# EAGLE design teensy_protocol_xl8r_3_6 (EAGLE 8.5.2)
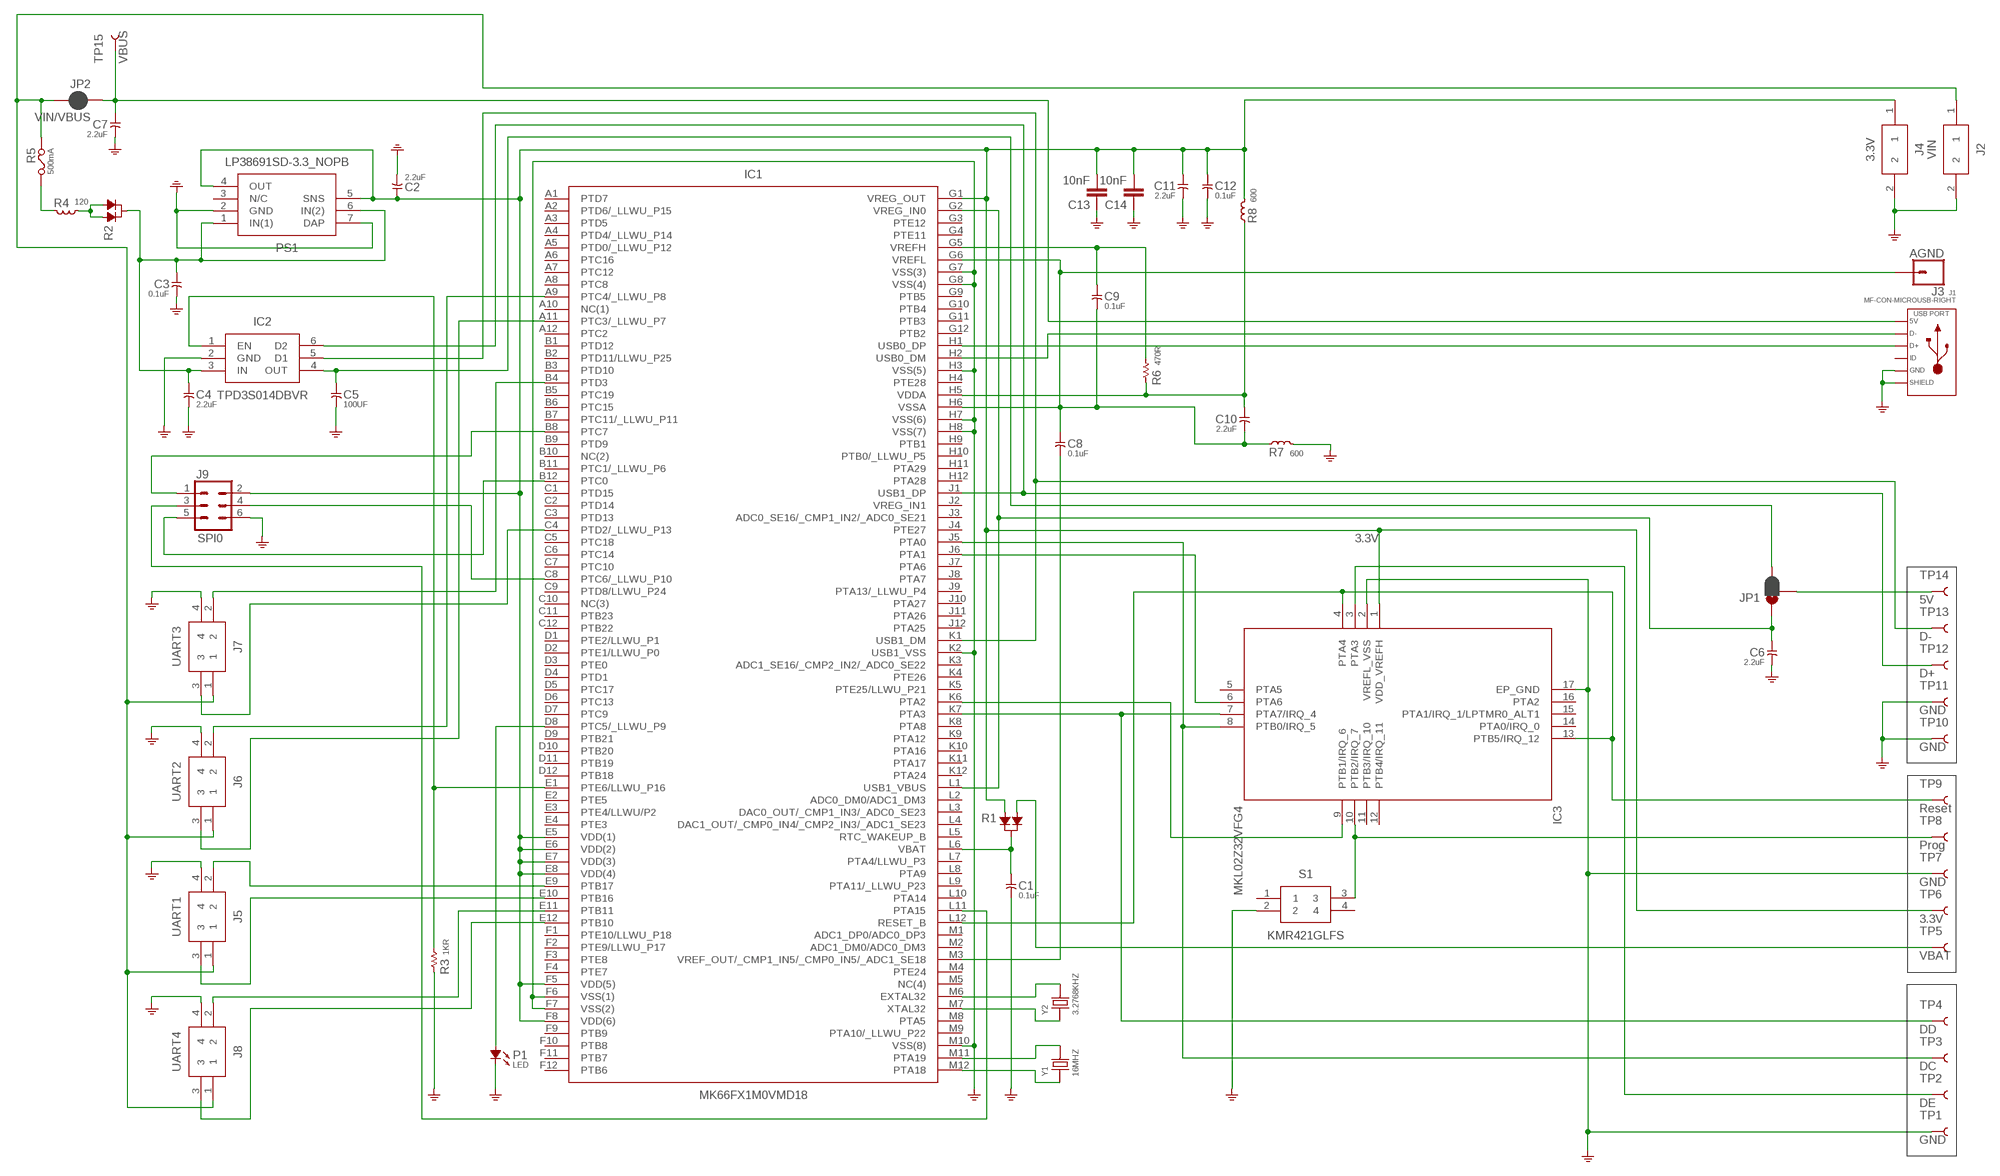
[diagram p0: schematic, sheet 1]

## Parts
C1  0.1uF  CAPACITOR-0.1UF  [C0603]
C2  2.2uF  CAPACITOR-2.2UF  [C0805]
C3  0.1uF  CAPACITOR-0.1UF  [C0603]
C4  2.2uF  CAPACITOR-2.2UF  [C0805]
C5  100UF  CAPACITOR-100UF  [C1206]
C6  2.2uF  CAPACITOR-2.2UF  [C0805]
C7  2.2uF  CAPACITOR-2.2UF  [C0805]
C8  0.1uF  CAPACITOR-0.1UF  [C0603]
C9  0.1uF  CAPACITOR-0.1UF  [C0603]
C10  2.2uF  CAPACITOR-2.2UF  [C0805]
C11  2.2uF  CAPACITOR-2.2UF  [C0805]
C12  0.1uF  CAPACITOR-0.1UF  [C0603]
C13  10nF  10NF-0603-50V-10%  [0603]
C14  10nF  10NF-0603-50V-10%  [0603]
IC1  MK66FX1M0VMD18  [BGA144C100P12X12_1300X1300X170]
IC2  TPD3S014DBVR  [SOT95P280X145-6N]
IC3  MKL02Z32VFG4  [QFN50P300X300X65-17N]
J1  MF-CON-MICROUSB-RIGHT  USB_MICRO_RIGHT  [MICROUSB-RIGHT]
J2  VIN  SM02B-GHS-TB(LF)(SN)  [SM02B-GHS-TB]
J3  AGND  CONN_01  [1X01]
J4  3.3V  SM02B-GHS-TB(LF)(SN)  [SM02B-GHS-TB]
J5  UART1  SM04B-GHS-TB(LF)(SN)  [SM04B-GHS-TB]
J6  UART2  SM04B-GHS-TB(LF)(SN)  [SM04B-GHS-TB]
J7  UART3  SM04B-GHS-TB(LF)(SN)  [SM04B-GHS-TB]
J8  UART4  SM04B-GHS-TB(LF)(SN)  [SM04B-GHS-TB]
J9  SPI0  CONN_03X2FEMALE  [2X3]
JP1  JUMPER-SMT_3_1-NC_PASTE_SILK  [SMT-JUMPER_3_1-NC_PASTE_SILK]
JP2  VIN/VBUS  JUMPER-SMT_2_NC_PASTE_SILK  [SMT-JUMPER_2_NC_PASTE_SILK]
P1  LED  [LED-0805]
PS1  LP38691SD-3.3_NOPB  [SON95P300X300X80-7N]
R1  DIODE_DUAL  [SOT-23]
R2  DIODE_DUAL  [SOT-23]
R3  1KR  RESISTOR-1KR  [R0603]
R4  120  FERRITE  [L0603]
R5  500mA  FUSE  [F0805]
R6  470R  RESISTOR-470R  [R0603]
R7  600  FERRITE  [L0603]
R8  600  FERRITE  [L0603]
S1  KMR421GLFS  [KMR_2]
TP1  GND  TEST-POINT3  [PAD.03X.03]
TP2  DE  TEST-POINT3  [PAD.03X.03]
TP3  DC  TEST-POINT3  [PAD.03X.03]
TP4  DD  TEST-POINT3  [PAD.03X.03]
TP5  VBAT  TEST-POINT3  [PAD.03X.03]
TP6  3.3V  TEST-POINT3  [PAD.03X.03]
TP7  GND  TEST-POINT3  [PAD.03X.03]
TP8  Prog  TEST-POINT3  [PAD.03X.03]
TP9  Reset  TEST-POINT3  [PAD.03X.03]
TP10  GND  TEST-POINT3  [PAD.03X.03]
TP11  GND  TEST-POINT3  [PAD.03X.03]
TP12  D+  TEST-POINT3  [PAD.03X.03]
TP13  D-  TEST-POINT3  [PAD.03X.03]
TP14  5V  TEST-POINT3  [PAD.03X.03]
TP15  VBUS  TEST-POINT3  [PAD.03X.03]
Y1  16MHZ  SMD-CRYSTAL-16MHZ-8PF-20PPM-40R(2P-5.0X3.2MM)  [X2-SMD-5.0X3.2X1.3MM]
Y2  3.2768KHZ  SMD-CRYSTAL-32.768KHZ-12.5PF-20PPM-90K(2P-L2.0X1.2MM)  [X2-SMD-L2.0X1.2X0.55MM]

## Nets
3.3V: C2.1 C11.1 C12.1 C13.2 C14.2 IC1.E5(VDD(1)) IC1.E6(VDD(2)) IC1.E7(VDD(3)) IC1.E8(VDD(4)) IC1.F5(VDD(5)) IC1.F8(VDD(6)) IC1.G1(VREG_OUT) IC3.1(VDD_VREFH) J4.1 J9.2 PS1.4(OUT) PS1.5(SNS) R1.2 R8.2 TP6.P$1
CS0: IC1.B12(PTC0) J9.5
GND [GND]: C1.2 C2.2 C3.2 C4.2 C5.2 C6.2 C7.2 C11.2 C12.2 C13.1 C14.1 IC1.F6(VSS(1)) IC1.F7(VSS(2)) IC1.G7(VSS(3)) IC1.G8(VSS(4)) IC1.H3(VSS(5)) IC1.H7(VSS(6)) IC1.H8(VSS(7)) IC1.K2(USB1_VSS) IC1.M10(VSS(8)) IC2.2(GND) IC3.2(VREFL_VSS) IC3.17(EP_GND) J1.5(GND) J1.S1(SLD) J1.S2(SLD) J1.S3(SLD) J1.S4(SLD) J1.S5(SLD) J1.S6(SLD) J2.2 J4.2 J5.4 J6.4 J7.4 J8.4 J9.6 P1.- PS1.2(GND) PS1.7(DAP) R3.1 R7.2 S1.2 TP1.P$1 TP7.P$1 TP10.P$1 TP11.P$1
MISO0: IC1.B8(PTC7) J9.1
MOSI0: IC1.C8(PTC6/_LLWU_P10) J9.4
N$1: IC1.K7(PTA3) IC3.7(PTA7/IRQ_4) TP4.P$1
N$2: IC1.J5(PTA0) IC3.8(PTB0/IRQ_5) TP3.P$1
N$3: IC1.K6(PTA2) IC3.9(PTB1/IRQ_6)
N$4: IC1.J6(PTA1) IC3.6(PTA6)
N$5: IC1.L12(RESET_B) IC3.4(PTA4) IC3.13(PTB5/IRQ_12) TP9.P$1
N$6: IC3.10(PTB2/IRQ_7) S1.3 TP8.P$1
N$7: IC3.3(PTA3) TP2.P$1
N$8 [GND]: C1.1 IC1.L6(VBAT) R1.3
N$9: IC1.E1(PTE6/LLWU_P16) IC2.1(EN) R3.2
N$10 [SUPPLY]: C3.1 C4.1 IC2.3(IN) PS1.1(IN(1)) PS1.6(IN(2)) R2.3
N$11: C5.1 IC2.4(OUT) JP1.3
N$12: C6.1 IC1.G2(VREG_IN0) IC1.L1(USB1_VBUS) JP1.1
N$13: IC1.K1(USB1_DM) IC2.5(D1) TP13.P$1
N$14: IC1.J1(USB1_DP) IC2.6(D2) TP12.P$1
N$15: IC1.M6(EXTAL32) Y2.2
N$16: IC1.M7(XTAL32) Y2.1
N$17 [SUPPLY]: JP1.2 TP14.P$1
N$18 [SUPPLY]: R2.1 R2.2 R4.2
N$19 [SUPPLY]: R4.1 R5.2
N$20: IC1.M11(PTA19) Y1.2
N$21: IC1.M12(PTA18) Y1.1
N$23 [GND]: C8.1 C9.2 C10.2 IC1.G6(VREFL) IC1.H6(VSSA) J3.1 R7.1
N$24: C8.2 IC1.M3(VREF_OUT/_CMP1_IN5/_CMP0_IN5/_ADC1_SE18)
N$25 [GND]: C9.1 IC1.G5(VREFH) R6.2
N$26 [GND]: C10.1 IC1.H5(VDDA) R6.1 R8.1
N$27: IC1.D8(PTC5/_LLWU_P9) P1.+
RX1: IC1.E9(PTB17) J5.2
RX2: IC1.A11(PTC3/_LLWU_P7) J6.3
RX3: IC1.C4(PTD2/_LLWU_P13) J7.3
RX4: IC1.E12(PTB10) J8.3
SCK0: IC1.L11(PTA15) J9.3
TX1: IC1.E10(PTB16) J5.3
TX2: IC1.A9(PTC4/_LLWU_P8) J6.2
TX3: IC1.B4(PTD3) J7.2
TX4: IC1.E11(PTB11) J8.2
USB0_DM [GND]: IC1.H2(USB0_DM) J1.2(D-)
USB0_DP [GND]: IC1.H1(USB0_DP) J1.3(D+)
VBAT [SUPPLY]: R1.1 TP5.P$1
VBUS [SUPPLY]: C7.1 J1.1(5V) JP2.1 TP15.P$1
VIN [SUPPLY]: J2.1 J5.1 J6.1 J7.1 J8.1 JP2.2 R5.1
Unconnected: IC1.A1(PTD7) IC1.A2(PTD6/_LLWU_P15) IC1.A3(PTD5) IC1.A4(PTD4/_LLWU_P14) IC1.A5(PTD0/_LLWU_P12) IC1.A6(PTC16) IC1.A7(PTC12) IC1.A8(PTC8) IC1.A10(NC(1)) IC1.A12(PTC2) IC1.B1(PTD12) IC1.B2(PTD11/LLWU_P25) IC1.B3(PTD10) IC1.B5(PTC19) IC1.B6(PTC15) IC1.B7(PTC11/_LLWU_P11) IC1.B9(PTD9) IC1.B10(NC(2)) IC1.B11(PTC1/_LLWU_P6) IC1.C1(PTD15) IC1.C2(PTD14) IC1.C3(PTD13) IC1.C5(PTC18) IC1.C6(PTC14) IC1.C7(PTC10) IC1.C9(PTD8/LLWU_P24) IC1.C10(NC(3)) IC1.C11(PTB23) IC1.C12(PTB22) IC1.D1(PTE2/LLWU_P1) IC1.D2(PTE1/LLWU_P0) IC1.D3(PTE0) IC1.D4(PTD1) IC1.D5(PTC17) IC1.D6(PTC13) IC1.D7(PTC9) IC1.D9(PTB21) IC1.D10(PTB20) IC1.D11(PTB19) IC1.D12(PTB18) IC1.E2(PTE5) IC1.E3(PTE4/LLWU/P2) IC1.E4(PTE3) IC1.F1(PTE10/LLWU_P18) IC1.F2(PTE9/LLWU_P17) IC1.F3(PTE8) IC1.F4(PTE7) IC1.F9(PTB9) IC1.F10(PTB8) IC1.F11(PTB7) IC1.F12(PTB6) IC1.G3(PTE12) IC1.G4(PTE11) IC1.G9(PTB5) IC1.G10(PTB4) IC1.G11(PTB3) IC1.G12(PTB2) IC1.H4(PTE28) IC1.H9(PTB1) IC1.H10(PTB0/_LLWU_P5) IC1.H11(PTA29) IC1.H12(PTA28) IC1.J2(VREG_IN1) IC1.J3(ADC0_SE16/_CMP1_IN2/_ADC0_SE21) IC1.J4(PTE27) IC1.J7(PTA6) IC1.J8(PTA7) IC1.J9(PTA13/_LLWU_P4) IC1.J10(PTA27) IC1.J11(PTA26) IC1.J12(PTA25) IC1.K3(ADC1_SE16/_CMP2_IN2/_ADC0_SE22) IC1.K4(PTE26) IC1.K5(PTE25/LLWU_P21) IC1.K8(PTA8) IC1.K9(PTA12) IC1.K10(PTA16) IC1.K11(PTA17) IC1.K12(PTA24) IC1.L2(ADC0_DM0/ADC1_DM3) IC1.L3(DAC0_OUT/_CMP1_IN3/_ADC0_SE23) IC1.L4(DAC1_OUT/_CMP0_IN4/_CMP2_IN3/_ADC1_SE23) IC1.L5(RTC_WAKEUP_B) IC1.L7(PTA4/LLWU_P3) IC1.L8(PTA9) IC1.L9(PTA11/_LLWU_P23) IC1.L10(PTA14) IC1.M1(ADC1_DP0/ADC0_DP3) IC1.M2(ADC1_DM0/ADC0_DM3) IC1.M4(PTE24) IC1.M5(NC(4)) IC1.M8(PTA5) IC1.M9(PTA10/_LLWU_P22) IC3.5(PTA5) IC3.11(PTB3/IRQ_10) IC3.12(PTB4/IRQ_11) IC3.14(PTA0/IRQ_0) IC3.15(PTA1/IRQ_1/LPTMR0_ALT1) IC3.16(PTA2) J1.4(ID) PS1.3(N/C) S1.1 S1.4

## Library data of the parts
C1 C3 C8 C9 C12 = t32_ref:CAPACITOR-0.1UF; DESC: 0.1uF / 16VDC / X7R; MF: Murata Electronics; MPN: GRM188R71C104KA01D; OC_MOUSER: 81-GRM39X104K16; PACKAGE: 0603; TYPE: Capacitor
C2 C4 C6 C7 C10 C11 = t32_ref:CAPACITOR-2.2UF; DESC: 2.2uF / 25 VDC / X7R; MF: Taiyo Yuden; MPN: TMK212B7225KG-TR; OC_MOUSER: 963-TMK212B7225KG-TR; PACKAGE: 0805; TYPE: Capacitor
C5 = t32_ref:CAPACITOR-100UF
C13 C14 = SparkFun-Capacitors:10NF: 0.01uF/10nF/10,000pF ceramic capacitors A capacitor is a passive two-terminal electrical component used to store electrical energy temporarily in an electric field. CAP-09321; PROD_ID: CAP-00867
IC1 = MK66FX1M0VMD18:MK66FX1M0VMD18: ARM Microcontrollers - MCU BL Microcontrollers <https://componentsearchengine.com/Images/1/MK66FX1M0VMD18.jpg> Source: Datasheet <http://cache.freescale.com/files/shared/doc/package_info/98ASA00222D.pdf>; DESCRIPTION: ARM Microcontrollers - MCU BL Microcontrollers; HEIGHT: 1.7mm; MANUFACTURER_NAME: Nexperia; MANUFACTURER_PART_NUMBER: MK66FX1M0VMD18; SUPPLIER_NAME: RS
IC2 = TPD3S014DBVR:TPD3S014DBVR: Current Limit Load Sw & TVS 0.5A SOT23-6 Texas Instruments TPD3S014DBVR Load Switch IC, Current Limit Switch, 4.5 5.5V, 6-Pin, SOT-23 <https://componentsearchengine.com/Images/1/TPD3S014DBVR.jpg> Source: Datasheet <http://www.ti.com/lit/ds/symlink/tpd3s044.pdf>; DESCRIPTION: Current Limit Load Sw & TVS 0.5A SOT23-6 Texas Instruments TPD3S014DBVR Load Switch IC, Current Limit Switch, 4.5 5.5V, 6-Pin, SOT-23; HEIGHT: 1.45mm; MANUFACTURER_NAME: Texas Instruments; MANUFACTURER_PART_NUMBER: TPD3S014DBVR; RS_PART_NUMBER: 9009703P; SUPPLIER_NAME: RS
IC3 = MKL02Z32VFG4:MKL02Z32VFG4: Freescale MKL02Z32VFG4, 32bit ARM Cortex M0 Microcontroller, 48MHz, 32 kB Flash, 16-Pin QFN <https://componentsearchengine.com/Images/1/MKL02Z32VFG4.jpg> Source: Datasheet <http://cache.nxp.com/files/32bit/doc/data_sheet/KL02P32M48SF0.pdf>; DESCRIPTION: Freescale MKL02Z32VFG4, 32bit ARM Cortex M0 Microcontroller, 48MHz, 32 kB Flash, 16-Pin QFN; HEIGHT: 0.65mm; MANUFACTURER_NAME: Nexperia; MANUFACTURER_PART_NUMBER: MKL02Z32VFG4; RS_PART_NUMBER: 7884723; SUPPLIER_NAME: RS
J1 = MF_Connectors:USB: Library: MF_Connectors Description: 5 Pin USB Connectors. SLD is the shield connection. Usually tied to ground through a small ferrite bead.; HOUSEPART: YES; MPN: MF-CON-MICROUSB-RIGHT; POPULATE: 1; URL: https://factory.macrofab.com/part/MF-CON-MICROUSB-RIGHT
J2 J4 = SM02B-GHS-TB(LF)(SN):SM02B-GHS-TB(LF)(SN): GH 1.25mm header side entry 2 way JST GH Series, 1.25mm Pitch 2 Way Shrouded Right Angle PCB Header, Surface Mount, Solder Termination <https://componentsearchengine.com/Images/3/SM02B-GHS-TB%28LF%29%28SN%29.jpg> Source: Datasheet <http://docs-europe.electrocomponents.com/webdocs/13ed/0900766b813ed075.pdf>; DESCRIPTION: GH 1.25mm header side entry 2 way JST GH Series, 1.25mm Pitch 2 Way Shrouded Right Angle PCB Header, Surface Mount, Solder Termination; HEIGHT: mm; MANUFACTURER_NAME: JST (JAPAN SOLDERLESS TERMINALS); MANUFACTURER_PART_NUMBER: SM02B-GHS-TB(LF)(SN); RS_PART_NUMBER: 7521790P; SUPPLIER_NAME: RS
J3 = SparkFun-Connectors:CONN_01: Single connection point. Often used as Generic Header-pin footprint for 0.1 inch spaced/style header connections On any of the 0.1 inch spaced packages, you can populate with these: Break Away Headers - Straight <https://www.sparkfun.com/products/116> (PRT-00116) Break Away Male Headers - Right Angle <https://www.sparkfun.com/products/553> (PRT-00553) Female Headers <https://www.sparkfun.com/products/115> (PRT-00115) Break Away Headers - Machine Pin <https://www.sparkfun.com/products/117> (PRT-00117) Break Away Female Headers - Swiss Machine Pin <https://www.sparkfun.com/products/743> (PRT-00743) This device is also useful as a general connection point to wire up your design to another part of your project. Our various solder wires solder well into these plated through hole pads. Hook-Up Wire - Assortment (Stranded, 22 AWG) <https://www.sparkfun.com/products/11375> (PRT-11375) Hook-Up Wire - Assortment (Solid Core, 22 AWG) <https://www.sparkfun.com/products/11367> (PRT-11367) View the entire wire category on our website here <https://www.sparkfun.com/categories/141> Special notes: SMTSO-256-ET is a "flush mount" nut for a 4-40 screw. We mostly use this on specialty testbeds; it is a nice way to connect hardware to your PCB at an adjustable hieght. Also note, the SNAP packages are for using a snappable style connector. We sell a baggie of snaps and they are also used on two LilyPad designs: Snap Assortment - 30 pack (male and female) <https://www.sparkfun.com/products/11347> (DEV-11347) LilyPad Arduino SimpleSnap <https://www.sparkfun.com/products/10941> (DEV-10941) LilyPad SimpleSnap Protoboard <https://www.sparkfun.com/products/10940> (DEV-10940)
J5-J8 = SM04B-GHS-TB(LF)(SN):SM04B-GHS-TB(LF)(SN): JST GH Series, 1.25mm Pitch 4 Way Right Angle PCB Header, Solder Termination, 1A <https://componentsearchengine.com/Images/3/SM04B-GHS-TB%28LF%29%28SN%29.jpg> Source: Datasheet <http://uk.rs-online.com/web/p/products/7521797>; DESCRIPTION: JST GH Series, 1.25mm Pitch 4 Way Right Angle PCB Header, Solder Termination, 1A; HEIGHT: mm; MANUFACTURER_NAME: JST (JAPAN SOLDERLESS TERMINALS); MANUFACTURER_PART_NUMBER: SM04B-GHS-TB(LF)(SN); RS_PART_NUMBER: 7521797; SUPPLIER_NAME: RS
J9 = SparkFun-Connectors:CONN_03X2: Multi connection point. Often used as Generic Header-pin footprint for 0.1 inch spaced/style header connections You can populate with any combo of single row headers, but if you'd like an exact match, check these: Header - 2x3 (Male, 0.1") <https://www.sparkfun.com/products/12807> (PRT-12807) Header - 2x3 (Female, 0.1") <https://www.sparkfun.com/products/13010> (PRT-13010) 2x3 Pin Shrouded Header <https://www.sparkfun.com/products/10877> (PRT-10877) On any of the 0.1 inch spaced packages, you can populate with these: Break Away Headers - Straight <https://www.sparkfun.com/products/116> (PRT-00116) Break Away Male Headers - Right Angle <https://www.sparkfun.com/products/553> (PRT-00553) Female Headers <https://www.sparkfun.com/products/115> (PRT-00115) Break Away Headers - Machine Pin <https://www.sparkfun.com/products/117> (PRT-00117) Break Away Female Headers - Swiss Machine Pin <https://www.sparkfun.com/products/743> (PRT-00743) Special note: the shrouded connector mates well with our 3x2 ribbon cables: Ribbon Crimp Connector - 6-pin (2x3, Female) <https://www.sparkfun.com/products/10651> (PRT-10651) Ribbon Cable - 6 wire (15ft) <https://www.sparkfun.com/products/10646> (PRT-10646); PROD_ID: CONN-11566; VALUE: FEMALE 2x3
JP1 = SparkFun-Jumpers:JUMPER-SMT_3_1-NC_PASTE: Normally closed solder jumper (1 of 2 connections) This jumper has an aperture in the stencil to allow solder paste to bridge one of the two connections. One connection is normally closed (NC), while the other is normally open (NO). Wick off the solder to open the connection. Reapply solder to reclose the connection. Apply solder to the other side instead to change the current path.
JP2 = SparkFun-Jumpers:JUMPER-SMT_2_NC_PASTE: Normally closed solder jumper This jumper has an aperture in the stencil to allow solder paste to bridge the split in the wire so it's normally closed (NC). Wick off the solder to open the connection. Reapply solder to reclose the connection.
P1 = t32_ref:LED; DESC: orange; MF: ROHM Semiconductor; MPN: SML-211DTT86; OC_MOUSER: 755-SML-211DTT86; PACKAGE: 0805; TYPE: LED
PS1 = LP38691SD-3.3_NOPB:LP38691SD-3.3_NOPB: Texas Instruments LP38691SD-3.3/NOPB, LDO Voltage Regulator, 0.5A, 3.3 V 2%, 2.7 10 Vin, 6-Pin LLP <https://componentsearchengine.com/Images/3/LP38691SD-3.3_NOPB.jpg> Source: Datasheet <http://www.ti.com/lit/ds/symlink/lp38693-q1.pdf>; DESCRIPTION: Texas Instruments LP38691SD-3.3/NOPB, LDO Voltage Regulator, 0.5A, 3.3 V 2%, 2.7 10 Vin, 6-Pin LLP; HEIGHT: 0.8mm; MANUFACTURER_NAME: Texas Instruments; MANUFACTURER_PART_NUMBER: LP38691SD-3.3/NOPB; RS_PART_NUMBER: 7616605P; SUPPLIER_NAME: RS
R1 R2 = t32_ref:DIODE_DUAL; DESC: Dual Schottky, common cat; MF: NXP Semiconductors; MPN: BAT54C,215; OC_MOUSER: 771-BAT54C-T/R; PACKAGE: SOT-23; TYPE: Diode
R3 = t32_ref:RESISTOR-1KR; DESC: 1KR / 1 % / 0.1 W; MF: Vishay; MPN: CRCW06031K00FKEA; OC_MOUSER: 71-CRCW0603-470-E3; PACKAGE: 0603; POPULATE: 1; TYPE: Resistor
R4 R7 R8 = t32_ref:FERRITE; DESC: 600R / 100MHz; MF: Murata Electronics; MPN: BLM18AG601SN1D; OC_MOUSER: 81-BLM11A601S; PACKAGE: 0603; TYPE: Ferrite
R5 = t32_ref:FUSE; DESC: 6V / 0.5A; MF: Bel Fuse; MPN: 0ZCK0050FF2E; OC_MOUSER: 530-0ZCK0050FF2E; PACKAGE: 0805; TYPE: PPTC
R6 = t32_ref:RESISTOR-470R; DESC: 470R / 1 % / 0.1 W; MF: Vishay; MPN: CRCW0603470RFKEA; OC_MOUSER: 71-CRCW0603-470-E3; PACKAGE: 0603; TYPE: Resistor
S1 = KMR421GLFS:KMR421GLFS: C & K COMPONENTS - KMR421GLFS - SWITCH, GROUND, 2N <https://componentsearchengine.com/Images/1/KMR421GLFS.jpg> Source: Datasheet <http://www.farnell.com/datasheets/1443639.pdf>; DESCRIPTION: C & K COMPONENTS - KMR421GLFS - SWITCH, GROUND, 2N; HEIGHT: mm; MANUFACTURER_NAME: C & K COMPONENTS; MANUFACTURER_PART_NUMBER: KMR421GLFS; SUPPLIER_NAME: RS
TP1-TP15 = SparkFun-Connectors:TEST-POINT: SparkFun Test Points Bare copper test points for troubleshooting or In-Circuit-Testing. These are used by our Production team for verifying production board runs using pogo-pins on test beds. SparkFun Products: SparkFun LSM9DS1 Breakout <https://www.sparkfun.com/products/13284> SparkFun PSOC <https://www.sparkfun.com/products/13714> SparkFun Load Cell Amplifier <https://www.sparkfun.com/products/13879>
Y1 = Seeed-Crystal Oscillator:SMD-CRYSTAL-16MHZ-8PF-20PPM-40R(2P-5.0X3.2MM): 306010054; MPN: X053201602002
Y2 = Seeed-Crystal Oscillator:SMD-CRYSTAL-32.768KHZ-12.5PF-20PPM-90K(2P-L2.0X1.2MM): 306010020; MPN: FC-12M

## Net classes
0 default: width 0.127 mm
1 GND: width 0.254 mm
2 SUPPLY: width 0.191 mm

## Board
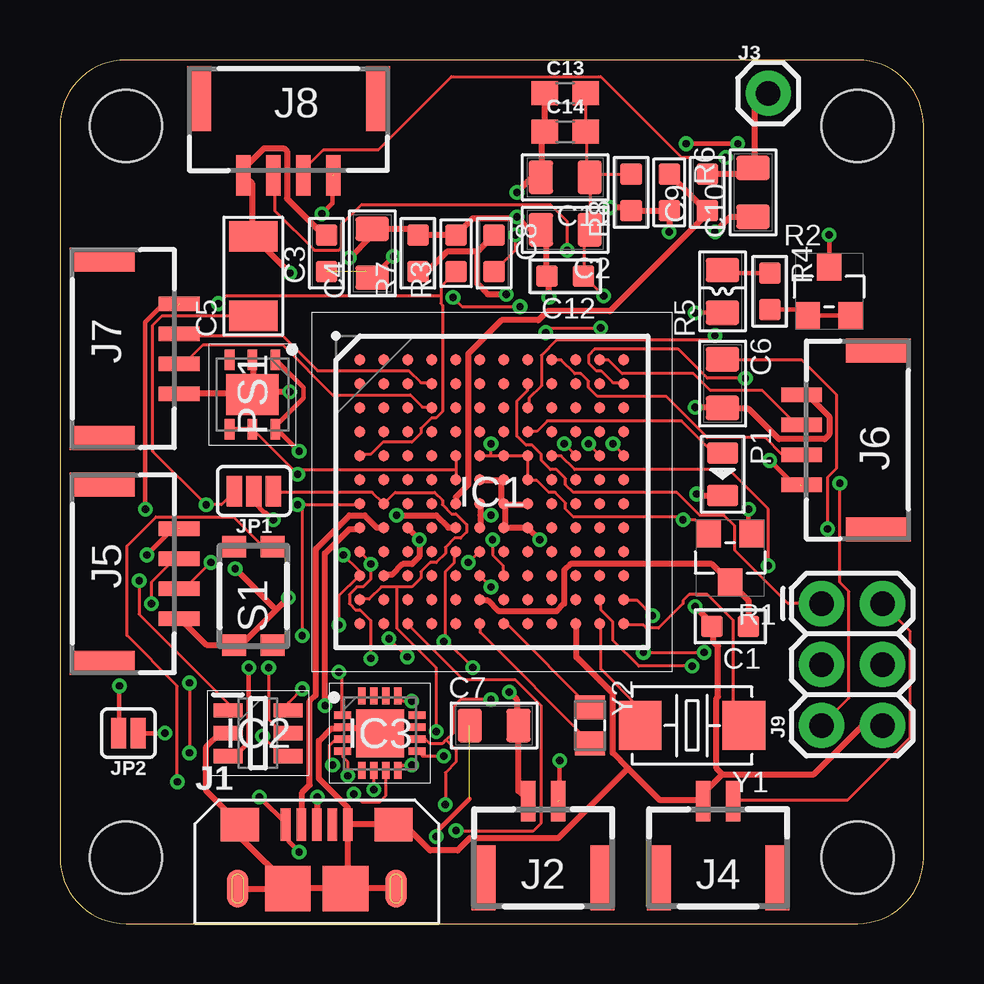
[diagram p1: board, top side]
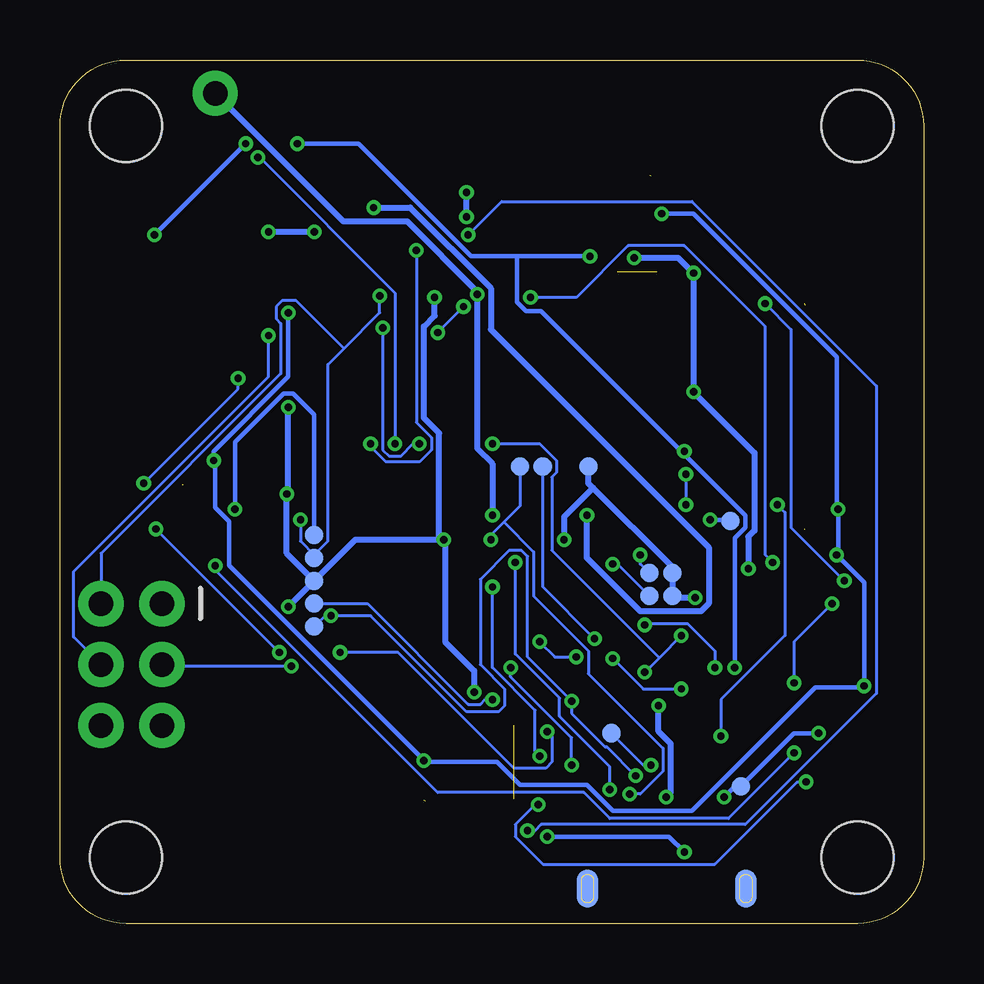
[diagram p2: board, bottom side, seen from below]

Size 36 x 36 mm. Coordinates in mm from the lower left corner, seen from the top.
Outline: 0,33.25 0,2.75 arc90 2.75,0 33.25,0 arc90 36,2.75 36,33.25 arc90 33.25,36 2.75,36 arc90 0,33.25
Copper layers (1*16): Top 0.035mm / dielectric 1.5mm / Bottom 0.035mm
Design rules "MF_Standard_2_Layer": minimum track width 5mil, minimum drill 12mil, track to track 5mil, track to pad 5mil, pad to pad 5mil, via to via 5mil, smd to smd 0mil, copper to edge 10mil, drill to drill 10mil, minimum pad ring 6mil, minimum via ring 6mil, stop-mask expansion 2mil, vias tented up to drill 25mil, thermal gap 10mil
Holes 3 mm at 2.75,2.75 2.75,33.25 33.25,33.25 33.25,2.75
tKeepout: area 0,30.8 to 5.2,36; area 30.8,30.8 to 36,36; area 0,0 to 5.2,5.2; area 30.8,0 to 36,5.2

### Footprints (pad centres in the part's own frame; a part is rotated, then mirrored left to right if it is on the bottom)
C0603 = smd 0.889 x 0.889: 1 0,0.762; 2 0,-0.762
C0805 = smd 1.397 x 1.016: 1 0,1.016; 2 0,-1.016
C1206 = smd 1.27 x 2.032: 1 -1.651,0; 2 1.651,0
0603 = smd 1.1 x 1: 1 -0.85,0; 2 0.85,0
BGA144C100P12X12_1300X1300X170 = smd 0.45 x 0.45: A1 -5.5,5.5; A2 -4.5,5.5; A3 -3.5,5.5; A4 -2.5,5.5; A5 -1.5,5.5; A6 -0.5,5.5; A7 0.5,5.5; A8 1.5,5.5; A9 2.5,5.5; A10 3.5,5.5; A11 4.5,5.5; A12 5.5,5.5; B1 -5.5,4.5; B2 -4.5,4.5; B3 -3.5,4.5; B4 -2.5,4.5; B5 -1.5,4.5; B6 -0.5,4.5; B7 0.5,4.5; B8 1.5,4.5; B9 2.5,4.5; B10 3.5,4.5; B11 4.5,4.5; B12 5.5,4.5; C1 -5.5,3.5; C2 -4.5,3.5; C3 -3.5,3.5; C4 -2.5,3.5; C5 -1.5,3.5; C6 -0.5,3.5; C7 0.5,3.5; C8 1.5,3.5; C9 2.5,3.5; C10 3.5,3.5; C11 4.5,3.5; C12 5.5,3.5; D1 -5.5,2.5; D2 -4.5,2.5; D3 -3.5,2.5; D4 -2.5,2.5; D5 -1.5,2.5; D6 -0.5,2.5; D7 0.5,2.5; D8 1.5,2.5; D9 2.5,2.5; D10 3.5,2.5; D11 4.5,2.5; D12 5.5,2.5; E1 -5.5,1.5; E2 -4.5,1.5; E3 -3.5,1.5; E4 -2.5,1.5; E5 -1.5,1.5; E6 -0.5,1.5; E7 0.5,1.5; E8 1.5,1.5; E9 2.5,1.5; E10 3.5,1.5; E11 4.5,1.5; E12 5.5,1.5; F1 -5.5,0.5; F2 -4.5,0.5; F3 -3.5,0.5; F4 -2.5,0.5; F5 -1.5,0.5; F6 -0.5,0.5; F7 0.5,0.5; F8 1.5,0.5; F9 2.5,0.5; F10 3.5,0.5; F11 4.5,0.5; F12 5.5,0.5; G1 -5.5,-0.5; G2 -4.5,-0.5; G3 -3.5,-0.5; G4 -2.5,-0.5; G5 -1.5,-0.5; G6 -0.5,-0.5; G7 0.5,-0.5; G8 1.5,-0.5; G9 2.5,-0.5; G10 3.5,-0.5; G11 4.5,-0.5; G12 5.5,-0.5; H1 -5.5,-1.5; H2 -4.5,-1.5; H3 -3.5,-1.5; H4 -2.5,-1.5; H5 -1.5,-1.5; H6 -0.5,-1.5; H7 0.5,-1.5; H8 1.5,-1.5; H9 2.5,-1.5; H10 3.5,-1.5; H11 4.5,-1.5; H12 5.5,-1.5; J1 -5.5,-2.5; J2 -4.5,-2.5; J3 -3.5,-2.5; J4 -2.5,-2.5; J5 -1.5,-2.5; J6 -0.5,-2.5; J7 0.5,-2.5; J8 1.5,-2.5; J9 2.5,-2.5; J10 3.5,-2.5; J11 4.5,-2.5; J12 5.5,-2.5; K1 -5.5,-3.5; K2 -4.5,-3.5; K3 -3.5,-3.5; K4 -2.5,-3.5; K5 -1.5,-3.5; K6 -0.5,-3.5; K7 0.5,-3.5; K8 1.5,-3.5; K9 2.5,-3.5; K10 3.5,-3.5; K11 4.5,-3.5; K12 5.5,-3.5; L1 -5.5,-4.5; L2 -4.5,-4.5; L3 -3.5,-4.5; L4 -2.5,-4.5; L5 -1.5,-4.5; L6 -0.5,-4.5; L7 0.5,-4.5; L8 1.5,-4.5; L9 2.5,-4.5; L10 3.5,-4.5; L11 4.5,-4.5; L12 5.5,-4.5; M1 -5.5,-5.5; M2 -4.5,-5.5; M3 -3.5,-5.5; M4 -2.5,-5.5; M5 -1.5,-5.5; M6 -0.5,-5.5; M7 0.5,-5.5; M8 1.5,-5.5; M9 2.5,-5.5; M10 3.5,-5.5; M11 4.5,-5.5; M12 5.5,-5.5
SOT95P280X145-6N = smd 1.2 x 0.6: 1 -1.25,0.95; 2 -1.25,0; 3 -1.25,-0.95; 4 1.25,-0.95; 5 1.25,0; 6 1.25,0.95
QFN50P300X300X65-17N = smd 0.7 x 0.3: 1 -1.55,0.75; 2 -1.55,0.25; 3 -1.55,-0.25; 4 -1.55,-0.75; 9 1.55,-0.75; 10 1.55,-0.25; 11 1.55,0.25; 12 1.55,0.75 | smd 0.3 x 0.7: 5 -0.75,-1.55; 6 -0.25,-1.55; 7 0.25,-1.55; 8 0.75,-1.55; 13 0.75,1.55; 14 0.25,1.55; 15 -0.25,1.55; 16 -0.75,1.55 | smd 2 x 2: 17 0,0
MICROUSB-RIGHT = smd 0.4 x 1.35: 1 -1.3,1.27; 2 -0.65,1.27; 3 0,1.27; 4 0.65,1.27; 5 1.3,1.27 | smd 0.9 x 1.6: S1 -3.3,-1.4; S2 3.3,-1.4 | smd 1.6 x 1.4: S3 -3.2,1.27; S4 3.2,1.27 | smd 1.9 x 1.9: S5 -1.2,-1.405; S6 1.2,-1.405 | smd 0.9 x 1.6 bottom: S7 -3.3,-1.4; S8 3.3,-1.4
SM02B-GHS-TB = smd 0.6 x 1.7: 1 0.625,0.34; 2 -0.625,0.34 | smd 1 x 2.7: 3 -2.475,-2.86; 4 2.475,-2.86
1X01 = drill 1.016 pad 1.88: 1 0,0
SM04B-GHS-TB = smd 0.6 x 1.7: 1 -1.875,0.2; 2 -0.625,0.2; 3 0.625,0.2; 4 1.875,0.2 | smd 1 x 2.7: 5 -3.725,-3; 6 3.725,-3
2X3 = drill 1.016 pad 1.88: 1 0,0; 2 0,2.54; 3 2.54,0; 4 2.54,2.54; 5 5.08,0; 6 5.08,2.54
SMT-JUMPER_3_1-NC_PASTE_SILK = smd 0.635 x 1.27: 1 -0.813,0; 2 0,0; 3 0.813,0
SMT-JUMPER_2_NC_PASTE_SILK = smd 0.635 x 1.27: 1 -0.406,0; 2 0.406,0
LED-0805 = smd 0.889 x 1.27: + -0.889,0; - 0.889,0
SON95P300X300X80-7N = smd 0.85 x 0.4: 1 -1.45,0.95; 2 -1.45,0; 3 -1.45,-0.95; 4 1.45,-0.95; 5 1.45,0; 6 1.45,0.95 | smd 1.7 x 2.2: 7 0,0
SOT-23 = smd 1.016 x 1.143: 1 -0.889,-1.016; 2 0.889,-1.016; 3 0,1.016
R0603 = smd 0.889 x 0.889: 1 0,0.762; 2 0,-0.762
L0603 = smd 0.889 x 0.889: 1 -0.762,0; 2 0.762,0
F0805 = smd 1.397 x 1.016: 1 0,0.889; 2 0,-0.889
KMR_2 = smd 0.9 x 1: 1 -2.05,-0.8; 2 -2.05,0.8; 3 2.05,-0.8; 4 2.05,0.8
PAD.03X.03 = smd 0.762 x 0.762: P$1 0,0
X2-SMD-5.0X3.2X1.3MM = smd 1.778 x 2.032: 1 -2.159,0; 2 2.159,0
X2-SMD-L2.0X1.2X0.55MM = smd 1 x 1.25: 1 -0.75,0; 2 0.75,0

### Placement (x,y rotation side)
C1  27.94,12.39 270 top
C2  21.06,28.92 270 top
C3  11.11,27.94 180 top
C4  13.02,27.94 180 top
C5  8.06,26.99 90 top
C6  27.62,22.51 0 top
C7  18.1,8.26 90 top
C8  18.1,27.94 0 top
C9  26.99,30.48 180 top
C10  28.89,30.48 180 top
C11  21.06,31.11 270 top
C12  21.06,26.99 270 top
C13  21.06,34.61 0 top
C14  21.06,33 0 top
IC1  18,18 0 top
IC2  8.26,7.94 0 top
IC3  13.34,7.94 0 top
J1  10.71,2.86 0 top
J2  20.14,4.76 0 top
J3  29.53,34.61 0 top
J4  27.43,4.76 0 top
J5  4.76,14.58 270 top
J6  31.11,20.16 90 top
J7  4.76,23.96 270 top
J8  9.53,31.39 180 top
J9  31.75,13.34 270 top
JP1  8.09,18.03 180 top
JP2  2.86,7.94 180 top
P1  27.62,18.73 270 top
PS1  8.02,22.06 270 top
R1  27.94,15.24 180 top
R2  32.07,26.35 0 top
R3  16.51,27.94 0 top
R4  29.59,26.35 270 top
R5  27.62,26.35 180 top
R6  25.4,30.48 180 top
R7  14.92,27.94 90 top
R8  23.81,30.48 90 top
S1  8.06,13.65 90 top
TP1  13.97,19.05 0 bottom
TP2  13.02,7.94 0 bottom
TP3  15.88,19.05 0 bottom
TP4  16.83,19.05 0 bottom
TP5  25.4,16.19 90 bottom
TP6  25.4,15.24 90 bottom
TP7  25.4,14.29 90 bottom
TP8  25.4,13.34 90 bottom
TP9  25.4,12.38 90 bottom
TP10  10.48,13.65 270 bottom
TP11  10.48,14.61 270 bottom
TP12  11.43,13.65 270 bottom
TP13  11.43,14.61 270 bottom
TP14  8.06,16.79 270 bottom
TP15  7.62,5.71 270 bottom
Y1  26.35,8.26 180 top
Y2  22.1,8.26 270 top

### Tracks (layer width: path | path; a pad name or v marks a point on that pad's centre or on a via)
3.3V  (via drill 0.3)
  Top 0.127: 16.51,18.92 IC1.E5 | 16.51,18.92 16.51,18.54 IC1.F5 | 10.1,17.46 12.45,17.46 IC1.G1 | v11.62,10.48 11.75,10.35 11.75,8.7 IC3.1 | 10.1,17.46 v10.1,12 | 10.1,17.46 v9.91,17.46 | 16.51,18.92 10.03,18.92 9.91,18.8 v9.91,18.73 8.06,20.57 PS1.5 8,20.64 7.11,20.64 PS1.4 | J9.2 35.43,12.19 35.43,7.75 32.83,5.14 28.07,5.14 J4.1 | 21.84,26.99 21.84,28.7 22.04,28.89 C2.1 22.1,28.96 22.1,31.05 C11.1 | C13.2 21.91,33.02 C14.2 21.97,32.96 21.97,31.43 22.16,31.24 C11.1 | R8.2 22.23,31.24 22.1,31.11 C11.1 | 17.97,19.49 18.48,19.49 IC1.E7 18.54,19.49 IC1.E8 | 17.97,19.49 17.53,19.49 IC1.E6 | IC1.E8 19.49,18.54 IC1.F8 19.56,18.48 19.88,18.48 20.38,17.97 20.64,17.97 21.08,17.53 21.08,17.27 21.4,16.95 25.84,16.95 v25.97,16.83 26.48,16.83 R1.2 | IC1.E8 | v22.67,26.16 21.84,26.99 | 21.84,26.99 C12.1 | 17.97,19.49 v17.97,20
  Bottom 0.127: v9.91,18.73 v9.91,17.46 | v10.1,12 11.02,11.08 | 11.02,11.08 v11.62,10.48 | 25.4,15.37 25.97,15.94 v25.97,16.83 | v22.67,26.16 22.67,25.46 24.16,23.97 | 24.16,23.97 24.83,23.3 24.83,15.94 25.4,15.37 | 25.4,15.37 TP6.P$1 | J9.2 34.29,15.43 26.8,22.92 26.8,25.02 26.99,25.21 26.99,25.72 26.73,25.97 26.16,25.97 24.16,23.97 | 11.02,11.08 15.49,15.56 15.49,18.61 15.3,18.8 15.3,19.3 16,20 v17.97,20
CS0  (via drill 0.3)
  Top 0.127: v28.57,22.73 26.99,22.73 25.78,23.94 22.29,23.94 22.04,23.69 22.04,23.37 22.35,23.05 22.54,23.05 23.05,22.54 23.5,22.54 IC1.B12 | v32.51,18.35 32.51,14.22 32.89,13.84 32.89,9.4 J9.5
  Bottom 0.127: v28.57,22.73 28.57,22.29 v32.51,18.35
GND  (via drill 0.3)
  Top 0.254: J5.4 5.02,12.7 6.1,11.62 7.24,11.62 S1.2 7.37,11.62 7.56,11.62 9.02,13.08 | IC1.K2 13.53,14.54 13.84,14.54 14.29,14.99 14.67,14.99 14.99,15.3 v14.99,16 14.54,16.45 IC1.H3 | v9.53,13.59 9.02,13.08 | C13.1 20.19,34.61 20.19,33.02 C14.1 20.19,32.89 20.07,32.77 20.07,31.11 C11.2 19.94,31.05 19.62,31.05 v19.05,30.48 | 19.11,29.4 19.56,28.96 19.94,28.96 C2.2 20.07,28.89 20.26,28.7 20.26,26.99 C12.2 20.38,26.92 v20.38,26.1 | 19.11,29.4 17.21,29.4 R3.1 R7.2 14.67,28.96 C4.2 12.95,28.89 12.95,28.64 v12.06,27.75 | v19.05,29.46 19.11,29.4 | PS1.2 8.06,23.5 8.06,22.1 PS1.7 | J7.4 5.02,22.1 7.94,22.1 PS1.7 | C3.2 10.99,28.7 9.46,30.23 9.46,32.19 9.34,32.32 8.51,32.32 7.68,31.5 7.68,31.24 J8.4 7.75,31.11 8,30.86 8,28.64 C5.2 8.13,28.57 v9.59,27.11 | v9.59,22.16 8.13,22.16 PS1.7 | v7.3,14.8 9.02,13.08 | J6.4 30.92,22.04 31.18,22.04 32.07,21.14 32.07,20.38 31.88,20.19 29.97,20.19 28.7,21.46 27.62,21.46 C6.2 27.56,21.53 v26.48,21.53 | J2.2 19.49,5.14 19.11,5.52 C7.2 19.05,8.32 19.05,9.34 v18.73,9.65 | IC1.F6 17.53,18.48 18.48,18.48 IC1.F7 18.41,18.41 18.41,17.59 IC1.G7 | IC1.G7 18.54,17.46 18.54,16.51 IC1.H7 18.67,16.51 IC1.H8 19.56,16.45 v20,16 | IC1.G8 19.49,17.46 18.67,17.46 IC1.G7 | v26.48,13.21 27.18,12.51 C1.2 27.24,12.32 27.24,11.75 27.43,11.56 27.43,9.46 27.37,9.4 27.37,6.48 27.62,6.22 | P1.- 26.61,17.84 v26.54,17.91 | IC2.2 6.67,7.94 6.1,7.37 6.1,5.52 7.49,4.13 J1.S3 7.62,4.06 7.62,3.49 9.53,1.59 J1.S5 | IC3.17 13.14,8.13 11.81,8.13 IC3.2 11.68,8.13 11.3,8.13 10.79,7.62 10.79,6.03 12,4.83 12,4.25 J1.5 | J1.5 J1.S4 14.35,4.13 15.43,3.05 16.57,3.05 17.08,3.56 20.77,3.56 23.69,6.48
  Top 0.254: 11.87,1.46 9.53,1.46 J1.S5 | 11.87,1.46 J1.S6 12,1.52 12,4.06 J1.5 | 23.69,6.48 25.02,5.14 26.8,5.14 J4.2 26.8,5.27 26.8,5.4 27.62,6.22 | 23.69,6.48 23.05,7.11 23.05,9.59 21.53,11.11 21.53,12.45 IC1.M10 | J9.6 33.47,8.26 31.43,6.22 27.62,6.22 | J1.S1 J1.S5 | J1.S2 11.87,1.46
  Bottom 0.254: TP1.P$1 13.97,18.35 13.78,18.16 | 13.78,18.16 10.54,14.92 10.54,14.67 TP11.P$1 TP10.P$1 10.41,13.59 v9.53,13.59 | v14.99,16 14.99,16.95 13.78,18.16 | v19.05,29.46 v19.05,30.48 | v12.06,27.75 10.22,27.75 v9.59,27.11 v9.59,22.16 7.05,19.62 7.05,16.38 7.3,16.13 v7.3,14.8 | v26.48,13.21 TP7.P$1 | TP7.P$1 26.54,15.43 v26.54,17.91 26.48,17.97 v26.48,21.53 | v20,16 23.69,16 TP7.P$1 | v18.73,9.65 18.73,10.54 19.94,11.75 19.94,15.94 v20,16 | v20.38,26.1 20.38,25.34 20.83,24.89 20.83,21.08 20.19,20.45 20.19,16.07 v20,16
MISO0
  Top 0.127: J9.1 30.35,13.34 28.13,15.56 28.13,16.57 27.69,17.02 26.67,17.02 25.72,17.97 21.4,17.97 21.08,18.29 21.08,18.54 20.7,18.92 20.45,18.92 20.07,19.3 20.07,19.56 19.68,19.94 19.43,19.94 19.05,20.32 19.05,21.78 19.49,22.23 19.49,22.48 IC1.B8
MOSI0  (via drill 0.3)
  Top 0.127: v27.3,24.51 27.11,24.32 20.7,24.32 20.07,23.69 20.07,22.42 19.56,21.91 19.56,21.53 IC1.C8
  Bottom 0.127: v27.3,24.51 27.3,22.8 35.43,14.67 35.43,11.94 J9.4
N$1  (via drill 0.3)
  Top 0.127: v18.03,16 18.03,15.37 18.48,14.92 18.48,14.54 IC1.K7 | v12.26,5.4 12.57,5.08 13.34,5.08 13.59,5.33 13.59,6.35 IC3.7
  Bottom 0.127: v18.03,16 18.03,16.19 17.49,16.73 | 17.49,16.73 16.83,17.4 TP4.P$1 | v12.26,5.4 11.81,5.4 10.86,6.35 10.86,7.3 13.97,10.41 13.97,11.37 16.26,13.65 16.26,15.49 17.49,16.73
N$2  (via drill 0.3)
  Top 0.127: v17.21,10.67 16.1,11.78 | 16.1,11.78 16.07,11.81 16.07,14.67 16.45,15.05 16.45,15.49 IC1.J5 | v14.67,6.6 14.29,6.6 14.1,6.41 IC3.8 | v14.48,11.11 v13.72,11.87 | v16,11.75 16.07,11.75 16.1,11.78
  Bottom 0.127: v17.21,10.67 17.21,10.29 14.67,7.75 v14.67,6.6 | TP3.P$1 15.88,14.03 v13.72,11.87 | v14.48,11.11 15.37,11.11 v16,11.75
N$3  (via drill 0.3)
  Top 0.127: v17.97,14.03 17.53,14.48 IC1.K6 | v16,6.99 15.11,6.99 14.92,7.18 IC3.9
  Bottom 0.127: v17.97,14.03 17.97,10.67 16.19,8.89 16.19,7.18 v16,6.99
N$4  (via drill 0.3)
  Top 0.127: v17.02,15.05 17.46,15.49 IC1.J6 | v13.08,5.59 13.08,6.35 IC3.6
  Bottom 0.127: v17.02,15.05 17.02,11.24 15.18,9.4 15.18,8.64 13.08,6.54 v13.08,5.59
N$5  (via drill 0.3)
  Top 0.127: v24.7,12.83 24.07,13.46 23.56,13.46 IC1.L12 | v12,6.16 12,6.73 11.81,6.92 11.81,7.18 IC3.4 | v14.67,9.27 14.29,9.27 14.1,9.46 IC3.13
  Bottom 0.127: TP9.P$1 24.96,12.83 v24.7,12.83 23.05,12.83 19.05,8.83 17.72,8.83 17.46,9.08 17.46,9.78 18.48,10.79 18.48,14.35 17.27,15.56 16.76,15.56 16.51,15.3 16.51,11.11 v14.67,9.27 14.67,8.76 13.27,7.37 13.21,7.37 v12,6.16
N$6  (via drill 0.3)
  Top 0.127: 16.1,7.65 16.38,7.94 16.38,9.02 16.7,9.34 v17.97,9.34 | 16.1,7.65 15.94,7.49 15.43,7.49 15.24,7.68 14.92,7.68 IC3.10 | v4.89,5.91 4.89,9.91 2.79,12 2.79,15.75 4,16.95 7.24,16.95 8.45,15.75 8.83,15.75 S1.3 | v16.07,4.95 16.07,6.29 16.51,6.73 16.51,7.24 16.1,7.65
  Bottom 0.127: v17.97,9.34 18.29,9.34 18.48,9.14 18.99,9.14 23.18,13.34 TP8.P$1 | v4.89,5.91 5.27,5.91 8.7,2.48 15.88,2.48 17.02,3.62 17.02,4.13 16.19,4.95 v16.07,4.95
N$7  (via drill 0.3)
  Top 0.127: v11.37,6.6 11.24,6.73 11.24,7.43 11.49,7.68 11.75,7.68 IC3.3
  Bottom 0.127: v11.37,6.6 11.68,6.6 TP2.P$1
N$8
  Top 0.254: IC1.L6 17.53,13.46 17.84,13.46 18.29,13.02 20.7,13.02 21.02,13.34 21.02,14.73 21.27,14.99 27.18,14.99 R1.3 28.7,13.46 C1.1
N$9  (via drill 0.3)
  Top 0.127: 15.88,26.16 15.88,26.54 R3.2 | 15.88,26.16 15.88,25.84 15.94,25.78 15.94,21.34 15.68,21.08 15.49,21.08 15.05,20.64 15.05,20.45 14.67,20.07 13.46,20.07 12.95,19.56 12.51,19.56 IC1.E1 | v3.3,14.29 3.3,12.89 6.99,9.21 6.99,8.89 IC2.1 | v6.6,25.84 6.92,26.16 15.88,26.16
  Bottom 0.127: v3.3,14.29 5.52,16.51 5.52,24.77 v6.6,25.84
N$10  (via drill 0.3)  (1 unrouted)
  Top 0.191: PS1.1 9.02,23.5 10.16,22.35 10.16,21.91 9.02,20.77 9.02,20.64 PS1.6 9.08,20.57 v9.97,19.68 | 12.76,27.18 C4.1 v13.91,27.81 | v32.07,28.7 R2.3 | v26.1,32.51 v28.26,32.51 | v7.87,10.67 7.87,7.56 7.37,7.05 7.05,7.05 IC2.3
  Bottom 0.191: v28.26,32.51 v32.07,28.7 | v26.1,32.51 23.56,32.51 18.86,27.81 16.95,27.81 | v13.91,27.81 16.95,27.81 | v7.87,10.67 7.87,16.07 7.43,16.51 7.43,17.02 10.03,19.62 | 10.03,19.62 15.94,25.53 16.57,25.53 16.95,25.91 16.95,27.81 | v9.97,19.68 10.03,19.62
N$11  (via drill 0.3)
  Top 0.127: v8.45,7.81 9.21,7.05 9.46,7.05 IC2.4 | JP1.3 7.24,17.97 6.73,17.46 v6.1,17.46 3.87,19.68 3.87,24.96 4.25,25.34 C5.1
  Bottom 0.127: v8.45,7.81 8.45,9.34 5.78,12 5.78,17.14 v6.1,17.46
N$12  (via drill 0.3)
  Top 0.127: 14.03,14.03 14.67,14.03 15.05,14.41 15.05,14.67 15.43,15.05 15.68,15.05 16.07,15.43 16.07,15.68 16.45,16.07 16.7,16.07 16.95,16.32 16.95,16.64 16.51,17.08 16.32,17.08 15.94,17.46 15.94,17.65 15.62,17.97 13.97,17.97 13.53,17.53 IC1.G2 13.46,17.53 13.02,17.97 8.95,17.97 JP1.1 | 14.03,14.03 13.4,14.03 12.89,13.53 12.51,13.53 IC1.L1 | v32,16.45 32,18.61 32.38,18.99 32.38,22.04 30.92,23.5 27.62,23.5 C6.1 | v24.32,11.3 v26.86,11.3 | v15.68,8 15.68,10.67 14.03,12.32 14.03,14.03
  Bottom 0.127: v26.86,11.3 v32,16.45 | v24.32,11.3 21.91,11.3 17.08,6.48 15.75,6.48 15.49,6.73 15.49,7.81 v15.68,8
N$13  (via drill 0.3)
  Top 0.127: v11.81,15.37 12.45,14.73 12.45,14.54 IC1.K1 12.45,14.48 11.62,13.65 v11.62,12.45 | IC2.5 9.27,7.94 8.7,8.51 v8.7,10.67
  Bottom 0.127: v11.81,15.37 11.81,14.99 TP13.P$1 | v8.7,10.67 8.7,11.37 9.84,12.51 11.56,12.51 v11.62,12.45
N$14  (via drill 0.3)
  Top 0.127: IC1.J1 12.95,15.05 v12.95,14.99 12.95,14.35 12.64,14.03 12.38,14.03 12.06,13.72 12.06,13.34 12.32,13.08 12.51,13.08 12.95,12.64 v12.95,11.05 | v10.1,9.78 9.53,9.21 9.53,8.89 IC2.6
  Bottom 0.127: v12.95,14.99 12.76,14.99 TP12.P$1 | v10.1,9.78 11.68,9.78 v12.95,11.05
N$15
  Top 0.127: IC1.M6 17.53,12.45 17.53,12.13 22.1,7.56 Y2.2
N$16
  Top 0.127: IC1.M7 18.54,12.45 18.67,12.45 Y2.1
N$17  (via drill 0.3)
  Top 0.191: v8.89,16.83 8.57,17.14 8.51,17.14 8.13,17.53 8.13,17.97 JP1.2
  Bottom 0.191: v8.89,16.83 8.06,16.83 TP14.P$1
N$18
  Top 0.191: R4.2 30.92,25.59 R2.1 R2.2
N$19
  Top 0.191: R4.1 27.75,27.11 R5.2
N$20
  Top 0.127: Y1.2 24.19,8.95 22.54,10.6 22.54,12.45 IC1.M11
N$21
  Top 0.127: Y1.1 28.07,8.7 28.07,12.64 26.99,13.72 26.23,13.72 25.97,13.46 25.97,13.34 24.96,12.32 24.45,12.32 24.32,12.45 23.56,12.45 IC1.M12
N$23  (via drill 0.3)
  Top 0.254: R7.1 15.3,27.18 16.13,28 17.4,28 | C8.1 17.4,28 | C9.2 28.64,31.24 C10.2 28.96,31.56 28.96,34.04 J3.1 | 17.53,17.02 17.53,17.46 IC1.G6 | 17.53,17.02 17.53,16.51 IC1.H6 | v17.97,17.02 17.53,17.02 | 17.4,28 17.4,26.67 17.84,26.23 v18.61,26.23
  Bottom 0.254: v17.97,17.02 17.97,19.18 18.61,19.81 v18.61,26.23 18.61,26.35 21.53,29.27 24.19,29.27 J3.1
N$24  (via drill 0.3)
  Top 0.127: v16.51,3.87 19.75,3.87 20.07,4.19 20.07,9.08 18.99,10.16 16.83,10.16 14.54,12.45 IC1.M3 | v18.99,28.7 18.99,28.07 C8.2
  Bottom 0.127: v16.51,3.87 16.19,3.87 15.94,4.13 7.43,4.13 1.97,9.59 1.97,22.42 9.65,30.1 17.59,30.1 v18.99,28.7
N$25
  Top 0.254: IC1.G5 16.51,17.53 16.51,17.78 17.02,18.29 17.02,23.75 18.41,25.15 19.94,25.15 20.32,25.53 22.92,25.53 26.99,29.59 C9.1 26.92,29.72 R6.2
N$26  (via drill 0.3)
  Top 0.254: v14.03,17.02 15.68,17.02 16.19,16.51 16.45,16.51 IC1.H5 | v22.92,29.84 23.69,29.84 R8.1 R6.1 v25.4,28.83 | C10.1 27.94,29.46 v27.3,28.83
  Bottom 0.254: v14.03,17.02 14.03,15.24 11.81,13.02 9.27,13.02 8.95,13.34 8.95,15.68 18.03,24.77 18.03,26.48 21.4,29.84 v22.92,29.84 | v25.4,28.83 v27.3,28.83
N$27
  Top 0.127: P1.+ 27.24,19.62 25.91,20.95 20.32,20.95 19.88,20.51 19.56,20.51 IC1.D8
RX1  (via drill 0.3)
  Top 0.127: v29.53,14.92 29.53,17.27 27.88,18.92 21.46,18.92 20.89,19.49 IC1.E9 | v5.4,10.03 v5.4,7.11 | v3.81,13.34 3.81,14.22 4.76,15.18 4.95,15.18 J5.2
  Bottom 0.127: v29.53,14.92 29.53,14.73 20.26,5.46 14.16,5.46 13.08,4.38 8.13,4.38 v5.4,7.11 | v5.4,10.03 5.4,11.75 v3.81,13.34
RX2
  Top 0.127: IC1.A11 22.54,23.5 22.86,23.5 23.43,22.92 26.42,22.92 27.11,22.23 29.27,22.23 30.67,20.83 30.86,20.83 J6.3
RX3
  Top 0.127: IC1.C4 15.49,21.53 15.11,21.53 14.61,22.04 11.37,22.04 9.27,24.13 5.97,24.13 5.21,23.37 5.02,23.37 J7.3
RX4  (via drill 0.3)
  Top 0.127: v23.05,20 23.5,19.56 IC1.E12 | v21.14,28.07 21.14,29.27 20.45,29.97 12.57,29.97 11.75,29.15 11.75,28.19 11.62,28.07 10.6,28.07 8.95,29.72 8.95,31.18 J8.3
  Bottom 0.127: v23.05,20 23.05,19.88 22.42,19.24 21.02,19.24 20.51,19.75 20.51,20.26 21.14,20.89 v21.14,28.07
SCK0  (via drill 0.3)
  Top 0.127: v26.35,10.73 24.13,10.73 23.05,11.81 23.05,12.57 22.54,13.08 22.54,13.46 IC1.L11
  Bottom 0.127: v26.35,10.73 31.69,10.73 J9.3
TX1  (via drill 0.3)
  Top 0.127: v21.02,20 21.46,19.56 IC1.E10 | v22.54,24.83 20.45,24.83 v20.26,24.64 | v19.18,25.72 16.76,25.72 v16.38,26.1 | v6.29,15.05 5.21,13.97 5.02,13.97 J5.3
  Bottom 0.127: v21.02,20 21.27,20 21.78,19.49 22.29,19.49 22.54,19.75 v22.54,24.83 | v19.18,25.72 v20.26,24.64 | v16.38,26.1 14.48,26.1 12.32,28.26 9.97,28.26 6.6,24.89 6.6,15.37 v6.29,15.05
TX2
  Top 0.127: IC1.A9 20.89,23.5 21.46,22.92 21.72,22.92 22.04,22.61 22.04,22.35 22.42,21.97 25.27,21.97 26.99,20.26 29.4,20.26 30.1,19.56 30.86,19.56 J6.2
TX3
  Top 0.127: IC1.B4 15.49,22.54 15.05,22.54 14.54,23.05 10.73,23.05 9.27,24.51 5.08,24.51 5.02,24.57 J7.2
TX4  (via drill 0.3)
  Top 0.127: v22.04,20 22.48,19.56 IC1.E11 | v27.75,31.94 25.91,31.94 22.54,35.31 16.32,35.31 13.27,32.26 10.99,32.26 10.16,31.43 10.16,31.24 J8.2
  Bottom 0.127: v22.04,20 22.04,26.29 27.69,31.94 v27.75,31.94
USB0_DM
  Top 0.254: IC1.H2 13.46,16.51 13.21,16.51 12.7,17.02 12.06,17.02 10.67,15.62 10.67,9.53 10.41,9.27 10.41,5.78 10.1,5.46 10.1,4.13 J1.2
USB0_DP  (via drill 0.3)
  Top 0.254: v11.05,9.08 11.05,15.43 12.06,16.45 12.45,16.45 IC1.H1 | v10.73,5.27 10.73,4.13 J1.3
  Bottom 0.254: v11.05,9.08 11.05,8 10.54,7.49 10.54,5.46 v10.73,5.27
VBAT  (via drill 0.3)
  Top 0.191: v28.7,17.27 28.7,16.38 R1.1
  Bottom 0.191: TP5.P$1 25.4,21.21 26.29,22.1 26.67,22.1 28.7,20.07 v28.7,17.27
VBUS  (via drill 0.3)  (1 unrouted)
  Top 0.191: v8.32,5.27 9.46,4.13 J1.1 9.53,4.06 9.53,3.43 v9.97,2.98 | v4.38,7.94 JP2.1 | 17.08,5.21 15.68,3.81 v15.68,3.62
  Bottom 0.191: v8.32,5.27 7.87,5.71 TP15.P$1 5.4,7.94 v4.38,7.94 | v15.68,3.62 10.6,3.62 v9.97,2.98
VIN  (via drill 0.3)  (5 unrouted)
  Top 0.191: v26.48,25.46 R5.1 | v29.59,19.3 30.61,18.29 30.86,18.29 | v20.83,6.79 20.83,5.14 | v2.48,9.91 2.48,7.94 JP2.2 | v3.62,15.37 4.7,16.45 J5.1 | 4.95,25.78 4.25,25.78 3.56,25.08 v3.56,17.27 | 11.37,31.18 11.37,30.04 v10.92,29.59
  Bottom 0.191: v26.48,25.46 26.48,22.8 29.59,19.68 v29.59,19.3 29.53,19.24 29.53,17.34 28.96,16.76 28.96,14.92 v20.83,6.79 20.77,6.73 17.78,6.73 16.83,5.78 14.03,5.78 12.95,4.7 9.65,4.7 4.51,9.84 2.54,9.84 v2.48,9.91 2.48,14.22 v3.62,15.37 3.56,15.43 v3.56,17.27 3.62,17.34 3.62,23.62 9.59,29.59 v10.92,29.59